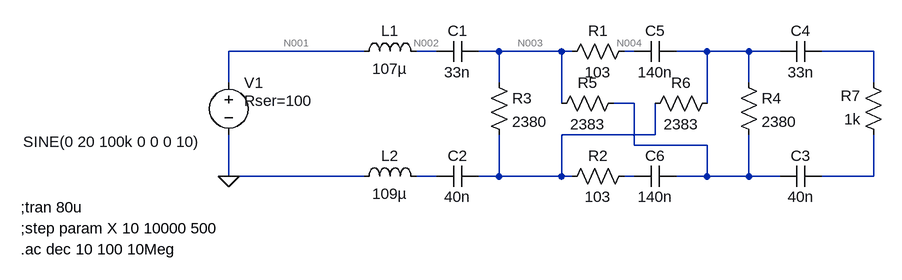
[diagram p0: schematic Draft2.asc]
Draft2.asc, the LTspice schematic file:
Version 4
SHEET 1 880 680
WIRE -48 176 -256 176
WIRE 64 176 32 176
WIRE 160 176 128 176
WIRE 256 176 160 176
WIRE 272 176 256 176
WIRE 368 176 352 176
WIRE 480 176 432 176
WIRE 544 176 480 176
WIRE 592 176 544 176
WIRE 736 176 656 176
WIRE -256 224 -256 176
WIRE 160 224 160 176
WIRE 544 224 544 176
WIRE 736 224 736 176
WIRE 256 256 256 176
WIRE 368 256 336 256
WIRE 480 256 480 176
WIRE 400 304 400 256
WIRE 400 304 256 304
WIRE 368 320 368 256
WIRE 480 320 368 320
WIRE -256 368 -256 304
WIRE -48 368 -256 368
WIRE 64 368 32 368
WIRE 160 368 160 304
WIRE 160 368 128 368
WIRE 256 368 256 304
WIRE 256 368 160 368
WIRE 272 368 256 368
WIRE 368 368 352 368
WIRE 480 368 480 320
WIRE 480 368 432 368
WIRE 544 368 544 304
WIRE 544 368 480 368
WIRE 592 368 544 368
WIRE 736 368 736 304
WIRE 736 368 656 368
FLAG -256 368 0
SYMBOL ind -64 192 R270
WINDOW 0 32 56 VTop 2
WINDOW 3 5 56 VBottom 2
SYMATTR InstName L1
SYMATTR Value 107µ
SYMATTR SpiceLine Rser=11.2
SYMBOL ind -64 384 R270
WINDOW 0 32 56 VTop 2
WINDOW 3 5 56 VBottom 2
SYMATTR InstName L2
SYMATTR Value 109µ
SYMATTR SpiceLine Rser=11.2
SYMBOL res 256 192 R270
WINDOW 0 32 56 VTop 2
WINDOW 3 0 56 VBottom 2
SYMATTR InstName R1
SYMATTR Value 103
SYMBOL res 256 384 R270
WINDOW 0 32 56 VTop 2
WINDOW 3 0 56 VBottom 2
SYMATTR InstName R2
SYMATTR Value 103
SYMBOL res 144 208 R0
SYMATTR InstName R3
SYMATTR Value 2380
SYMBOL res 528 208 R0
SYMATTR InstName R4
SYMATTR Value 2380
SYMBOL res 352 240 R90
WINDOW 0 0 56 VBottom 2
WINDOW 3 32 56 VTop 2
SYMATTR InstName R5
SYMATTR Value 2383
SYMBOL res 496 240 R90
WINDOW 0 0 56 VBottom 2
WINDOW 3 32 56 VTop 2
SYMATTR InstName R6
SYMATTR Value 2383
SYMBOL res 752 320 R180
WINDOW 0 36 76 Left 2
WINDOW 3 36 40 Left 2
SYMATTR InstName R7
SYMATTR Value 1k
SYMBOL cap 128 160 R90
WINDOW 0 0 32 VBottom 2
WINDOW 3 32 32 VTop 2
SYMATTR InstName C1
SYMATTR Value 33n
SYMBOL cap 128 352 R90
WINDOW 0 0 32 VBottom 2
WINDOW 3 32 32 VTop 2
SYMATTR InstName C2
SYMATTR Value 40n
SYMBOL cap 656 352 R90
WINDOW 0 0 32 VBottom 2
WINDOW 3 32 32 VTop 2
SYMATTR InstName C3
SYMATTR Value 40n
SYMBOL cap 656 160 R90
WINDOW 0 0 32 VBottom 2
WINDOW 3 32 32 VTop 2
SYMATTR InstName C4
SYMATTR Value 33n
SYMBOL voltage -256 208 R0
WINDOW 3 -316 107 Left 2
WINDOW 39 24 44 Left 2
SYMATTR Value SINE(0 20 100k 0 0 0 10)
SYMATTR Value2 AC 1 0
SYMATTR SpiceLine Rser=100
SYMATTR InstName V1
SYMBOL cap 432 160 R90
WINDOW 0 0 32 VBottom 2
WINDOW 3 32 32 VTop 2
SYMATTR InstName C5
SYMATTR Value 140n
SYMBOL cap 432 352 R90
WINDOW 0 0 32 VBottom 2
WINDOW 3 32 32 VTop 2
SYMATTR InstName C6
SYMATTR Value 140n
TEXT -576 416 Left 2 !;tran 80u
TEXT -576 448 Left 2 !;step param X 10 10000 500
TEXT -576 480 Left 2 !.ac dec 10 100 10Meg

The netlist it stands for:
* Draft2.asc
L1 N001 N002 107µ Rser=11.2
L2 0 N009 109µ Rser=11.2
R1 N003 N004 103
R2 N008 N010 103
R3 N003 N008 2380
R4 N005 N007 2380
R5 N007 N003 2383
R6 N005 N008 2383
R7 N011 N006 1k
C1 N003 N002 33n
C2 N008 N009 40n
C3 N011 N007 40n
C4 N006 N005 33n
V1 N001 0 SINE(0 20 100k 0 0 0 10) AC 1 0 Rser=100
C5 N005 N004 140n
C6 N007 N010 140n
;tran 80u
;step param X 10 10000 500
.ac dec 10 100 10Meg
.backanno
.end

* Results of the author's LTspice run, read from the files saved beside the schematic
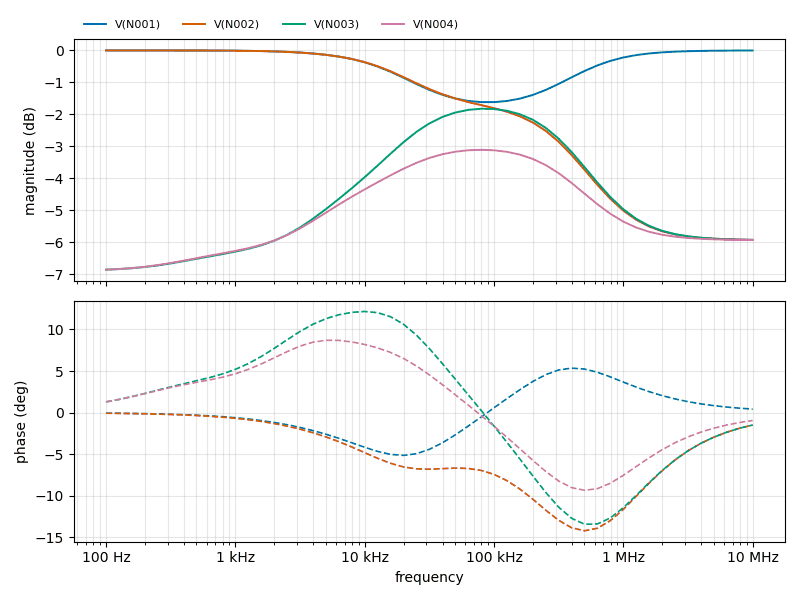
[diagram p1: AC Analysis of Draft2.asc, plotted from the saved traces]
* AC Analysis, 1 run:
*   V(N001): -0.00 dB at 100 Hz, -0.00 dB at 10 MHz, peak -0.00 dB at 100 Hz
*   V(N002): -0.00 dB at 100 Hz, -5.93 dB at 10 MHz, peak -0.00 dB at 100 Hz, 3 dB below the peak at 344.4 kHz
*   V(N003): -6.86 dB at 100 Hz, -5.93 dB at 10 MHz, peak -1.83 dB at 79.43 kHz, 3 dB below the peak at 5.51 kHz and 921.5 kHz
*   V(N004): -6.86 dB at 100 Hz, -5.93 dB at 10 MHz, peak -3.11 dB at 79.43 kHz, 3 dB below the peak at 1.463 kHz